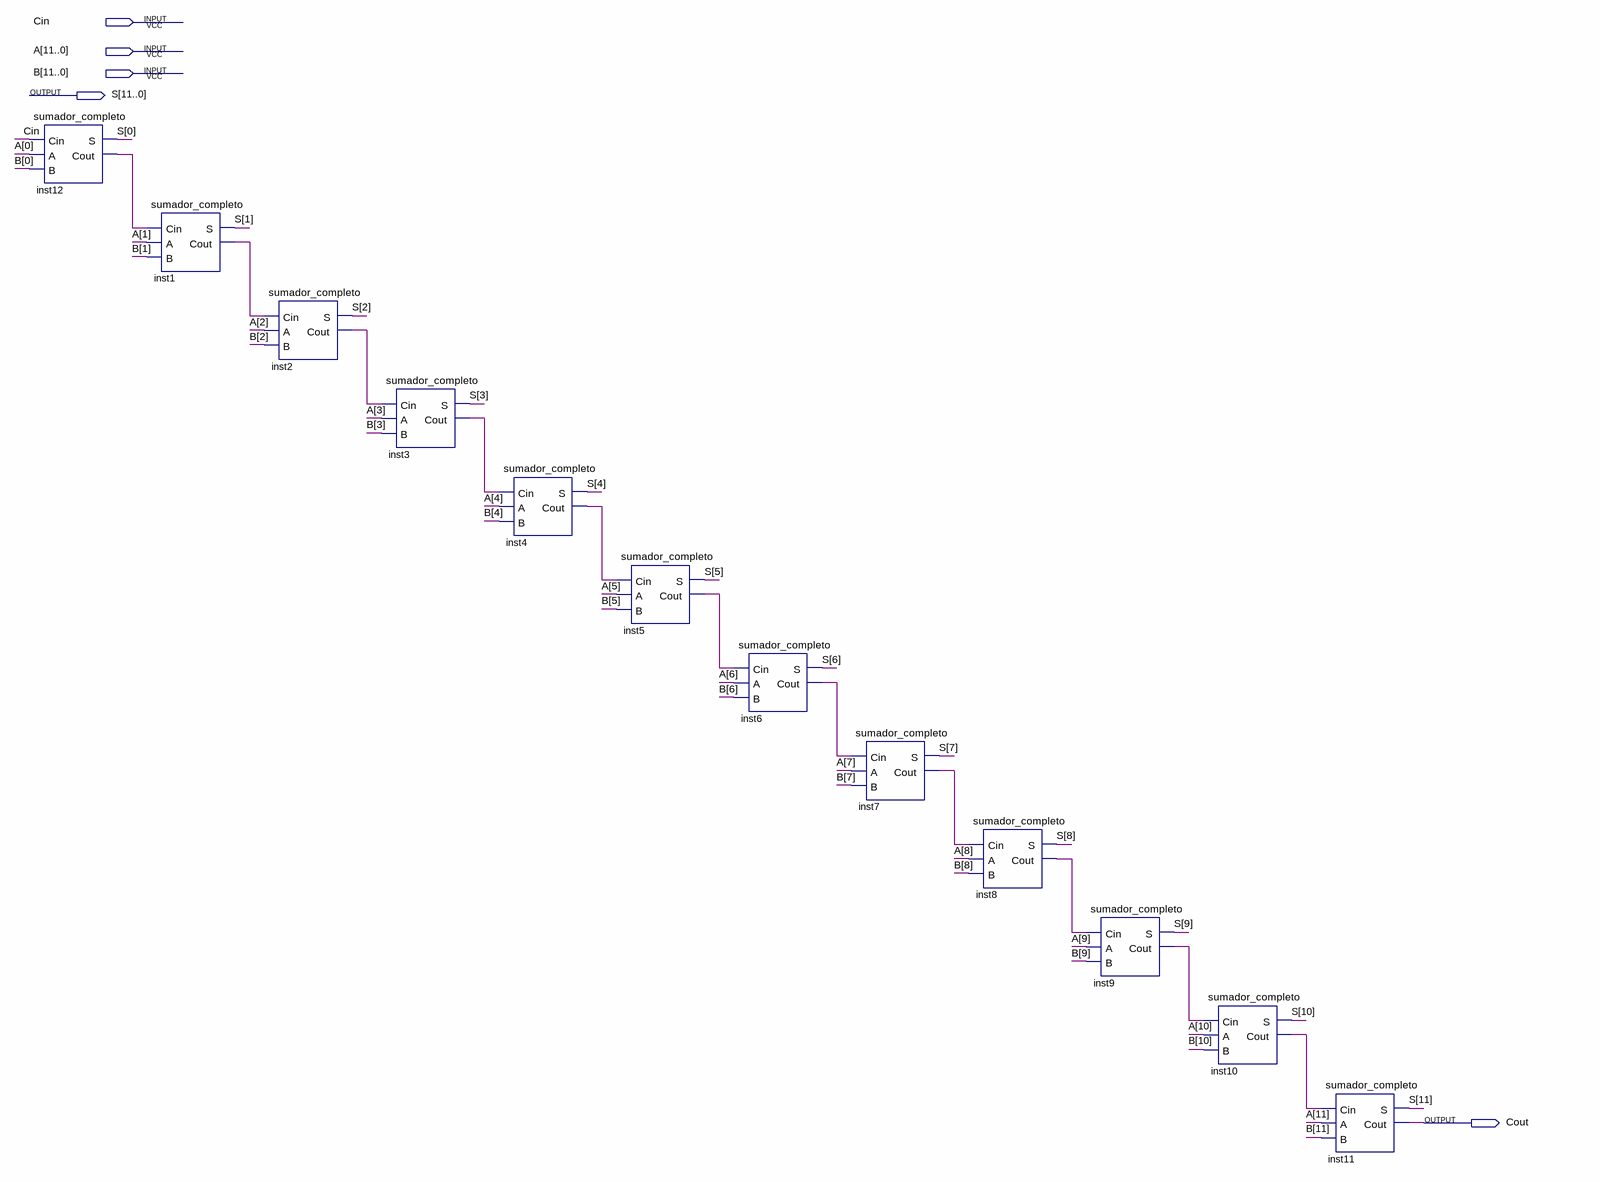
[diagram p0: schematic sheet]
// Quartus schematic sumador_12bits_serie.bdf as structural Verilog: 12 symbols, 5 pins
module sumador_12bits_serie (
  input  Cin,
  input  [11:0] A,
  input  [11:0] B,
  output [11:0] S,
  output Cout
);

  wire inst1_cout, inst2_cout, inst3_cout, inst4_cout, inst5_cout, inst6_cout, inst7_cout, inst8_cout,
       inst9_cout, inst10_cout, inst12_cout;

  sumador_completo inst12 (.Cin(Cin), .A(A[0]), .B(B[0]), .S(S[0]), .Cout(inst12_cout));
  sumador_completo inst1 (.Cin(inst12_cout), .A(A[1]), .B(B[1]), .S(S[1]), .Cout(inst1_cout));
  sumador_completo inst2 (.Cin(inst1_cout), .A(A[2]), .B(B[2]), .S(S[2]), .Cout(inst2_cout));
  sumador_completo inst3 (.Cin(inst2_cout), .A(A[3]), .B(B[3]), .S(S[3]), .Cout(inst3_cout));
  sumador_completo inst4 (.Cin(inst3_cout), .A(A[4]), .B(B[4]), .S(S[4]), .Cout(inst4_cout));
  sumador_completo inst5 (.Cin(inst4_cout), .A(A[5]), .B(B[5]), .S(S[5]), .Cout(inst5_cout));
  sumador_completo inst6 (.Cin(inst5_cout), .A(A[6]), .B(B[6]), .S(S[6]), .Cout(inst6_cout));
  sumador_completo inst7 (.Cin(inst6_cout), .A(A[7]), .B(B[7]), .S(S[7]), .Cout(inst7_cout));
  sumador_completo inst8 (.Cin(inst7_cout), .A(A[8]), .B(B[8]), .S(S[8]), .Cout(inst8_cout));
  sumador_completo inst9 (.Cin(inst8_cout), .A(A[9]), .B(B[9]), .S(S[9]), .Cout(inst9_cout));
  sumador_completo inst10 (.Cin(inst9_cout), .A(A[10]), .B(B[10]), .S(S[10]), .Cout(inst10_cout));
  sumador_completo inst11 (.Cin(inst10_cout), .A(A[11]), .B(B[11]), .S(S[11]), .Cout(Cout));
endmodule
